# Altium schematic sheet HV60D_Top.SchDoc
size A1
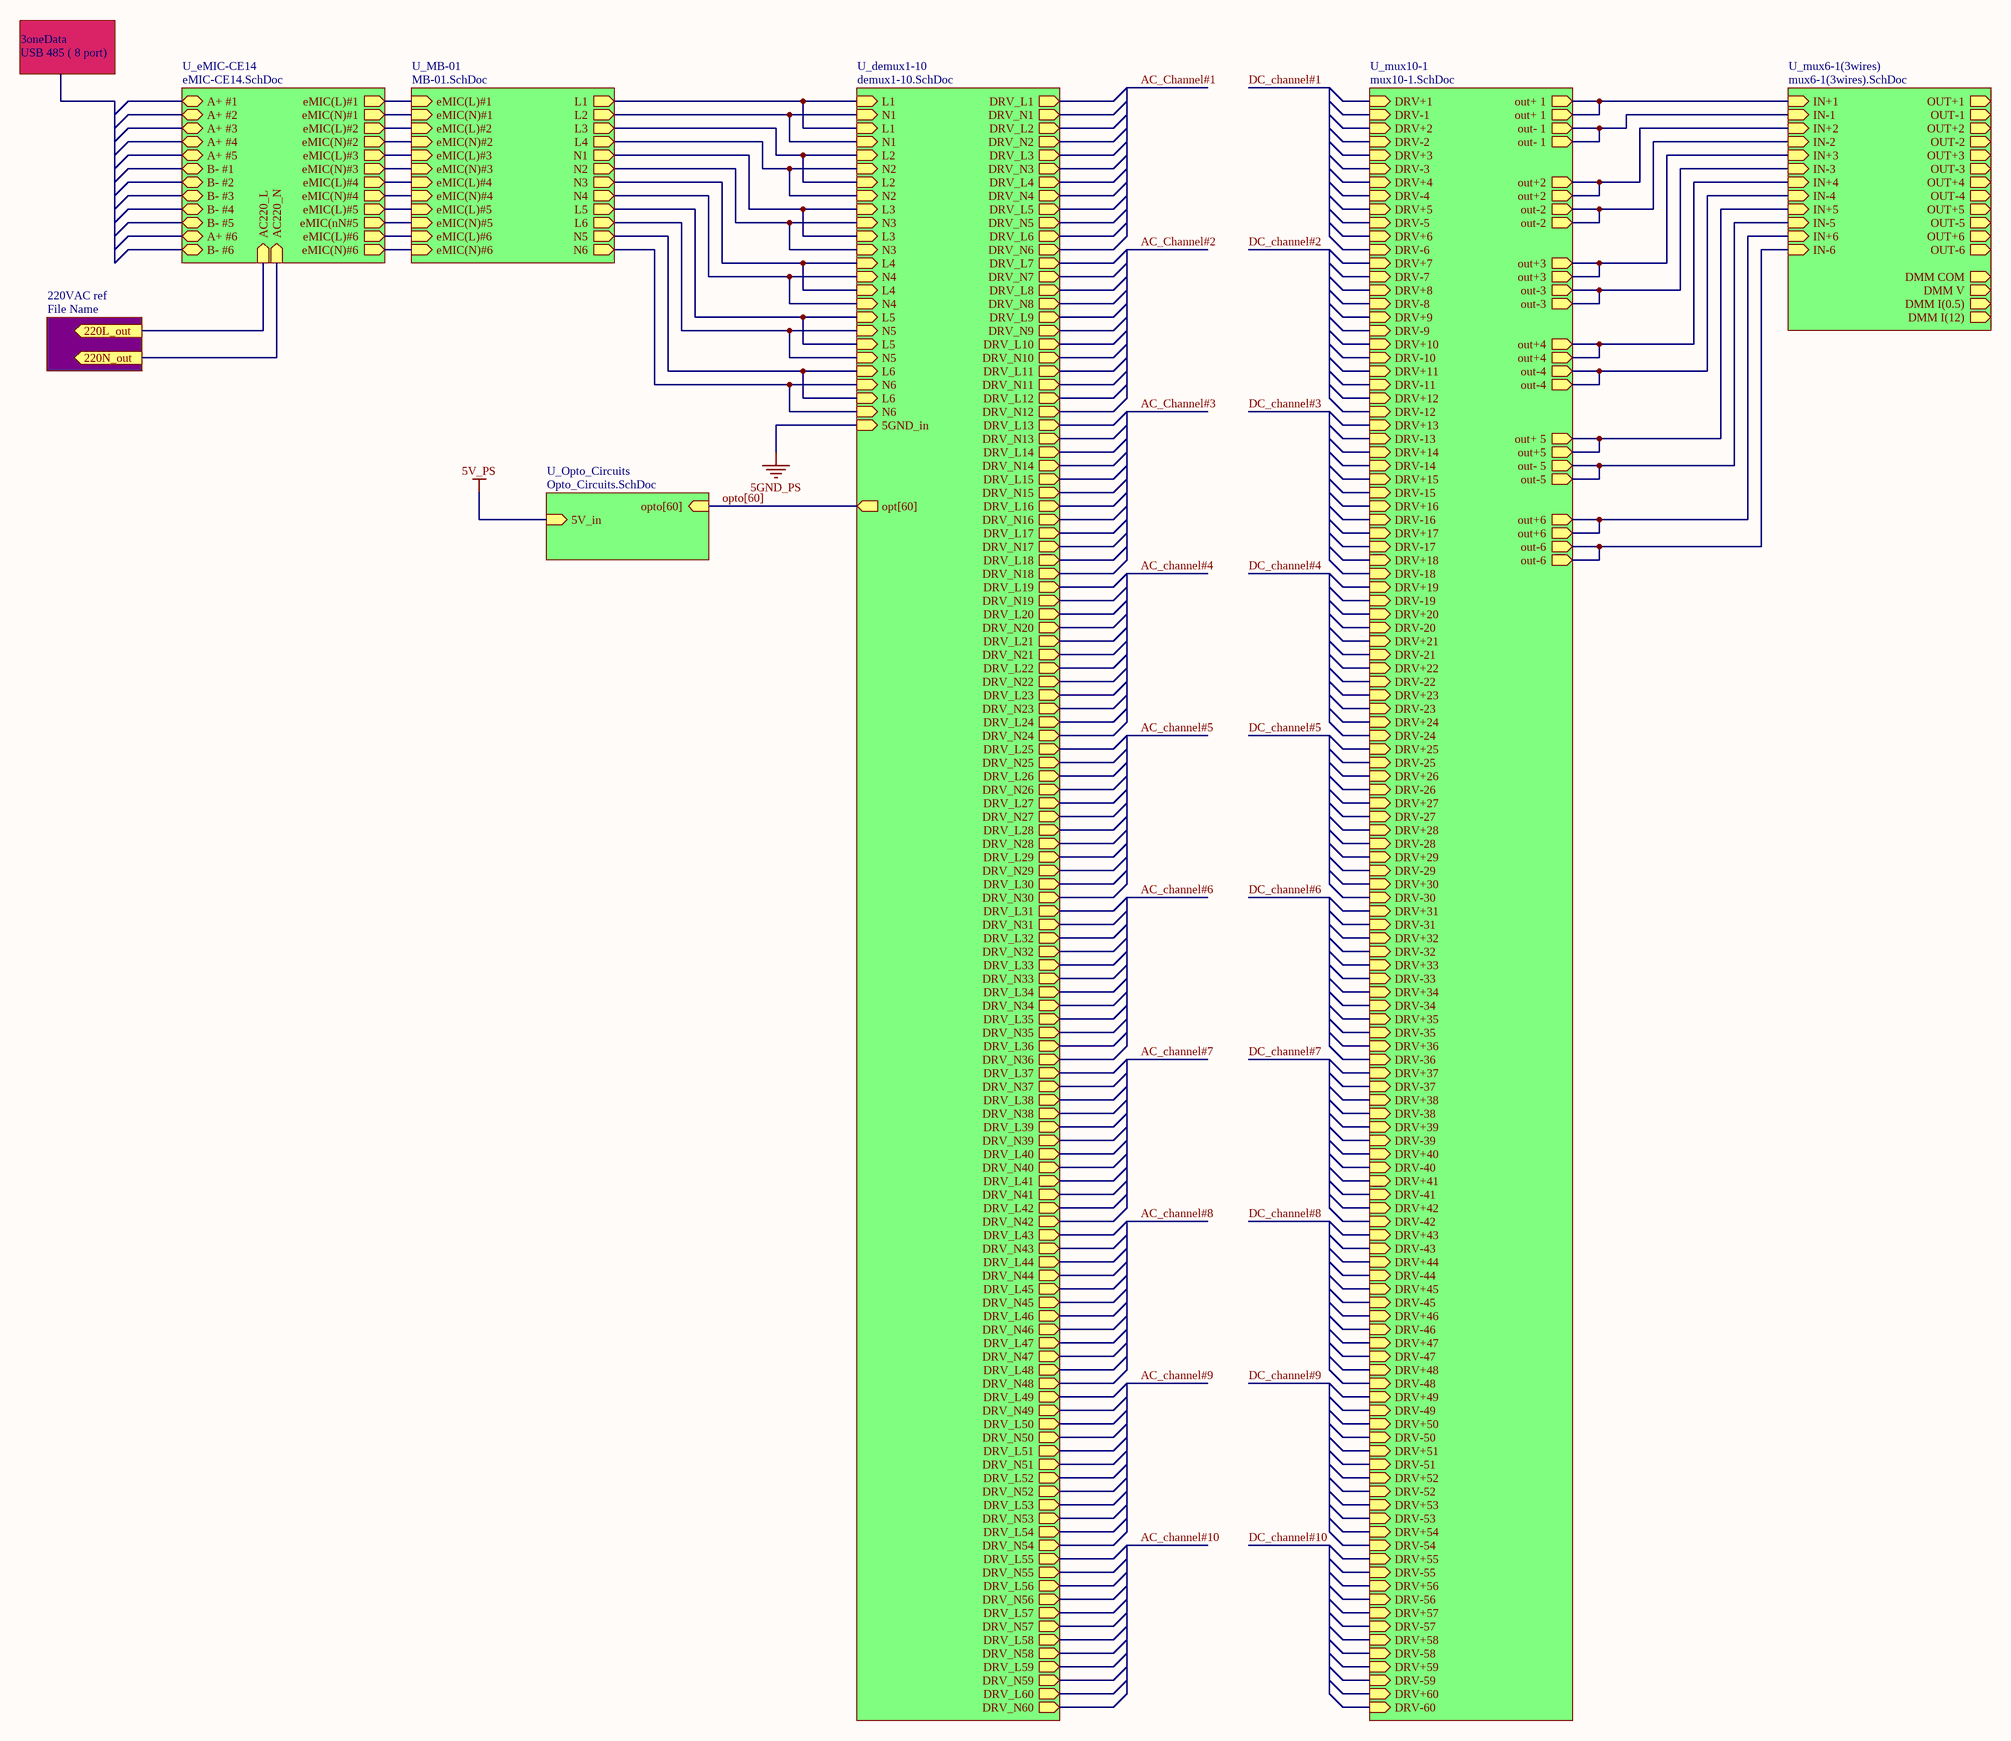
[diagram p0: HV60D_Top.SchDoc]

## Sub-sheets
220VAC ref = File Name: no entries
U_demux1-10 = demux1-10.SchDoc: L1 (in), N1 (in), L1 (in), N1 (in), DRV_L1 (out), DRV_L7 (out), L5 (in), N5 (in), L2 (in), N2 (in), L2 (in), N2 (in), L5 (in), N5 (in), L3 (in), N3 (in), L3 (in), N3 (in), L6 (in), N6 (in), L4 (in), N4 (in), L4 (in), N4 (in), L6 (in), N6 (in), DRV_L2 (out), DRV_L3 (out), DRV_L4 (out), DRV_L49 (out), DRV_L51 (out), DRV_L8 (out), DRV_L9 (out), DRV_L10 (out), DRV_L55 (out), DRV_L13 (out), DRV_L14 (out), DRV_L15 (out), DRV_L16 (out), DRV_L5 (out), DRV_L6 (out), DRV_L19 (out), DRV_L20 (out), DRV_L21 (out), DRV_L22 (out), DRV_L11 (out), DRV_L12 (out), DRV_L25 (out), DRV_L26 (out), DRV_L27 (out), DRV_L28 (out), DRV_L17 (out), DRV_L18 (out), DRV_L31 (out), DRV_L32 (out), DRV_L33 (out), DRV_L34 (out), DRV_L23 (out), DRV_L24 (out), DRV_L37 (out), DRV_L38 (out), DRV_L39 (out), DRV_L40 (out), DRV_L29 (out), DRV_L30 (out), DRV_L43 (out), DRV_L44 (out), DRV_L45 (out), DRV_L46 (out), DRV_L50 (out), DRV_L52 (out), DRV_L58 (out), DRV_L56 (out), DRV_L57 (out), DRV_L35 (out), DRV_L41 (out), DRV_L47 (out), DRV_L53 (out), DRV_L59 (out), DRV_L36 (out), DRV_L42 (out), DRV_L48 (out), DRV_L54 (out), DRV_L60 (out), DRV_N1 (out), DRV_N2 (out), DRV_N3 (out), DRV_N4 (out), DRV_N5 (out), DRV_N6 (out), DRV_N7 (out), DRV_N8 (out), DRV_N9 (out), DRV_N10 (out), DRV_N11 (out), DRV_N12 (out), DRV_N13 (out), DRV_N14 (out), DRV_N15 (out), DRV_N16 (out), DRV_N17 (out), DRV_N18 (out), DRV_N19 (out), DRV_N20 (out), DRV_N21 (out), DRV_N22 (out), DRV_N23 (out), DRV_N24 (out), DRV_N25 (out), DRV_N26 (out), DRV_N27 (out), DRV_N28 (out), DRV_N29 (out), DRV_N30 (out), DRV_N31 (out), DRV_N32 (out), DRV_N33 (out), DRV_N34 (out), DRV_N35 (out), DRV_N36 (out), DRV_N37 (out), DRV_N38 (out), DRV_N39 (out), DRV_N40 (out), DRV_N41 (out), DRV_N42 (out), DRV_N43 (out), DRV_N44 (out), DRV_N45 (out), DRV_N46 (out), DRV_N47 (out), DRV_N48 (out), DRV_N49 (out), DRV_N50 (out), DRV_N51 (out), DRV_N52 (out), DRV_N53 (out), DRV_N54 (out), DRV_N55 (out), DRV_N56 (out), DRV_N57 (out), DRV_N58 (out), DRV_N59 (out), DRV_N60 (out), opt[60] (out), 5GND_in (in)
U_eMIC-CE14 = eMIC-CE14.SchDoc: A+ #1 (bidir), A+ #2 (bidir), A+ #3 (bidir), A+ #4 (bidir), A+ #5 (bidir), B- #1 (bidir), B- #2 (bidir), B- #3 (bidir), B- #4 (bidir), B- #5 (bidir), A+ #6 (bidir), B- #6 (bidir), AC220_L (in), AC220_N (in), eMIC(L)#1 (out), eMIC(N)#1 (out), eMIC(L)#2 (out), eMIC(L)#3 (out), eMIC(L)#4 (out), eMIC(L)#5 (out), eMIC(L)#6 (out), eMIC(N)#2 (out), eMIC(N)#3 (out), eMIC(N)#4 (out), eMIC(nN#5 (out), eMIC(N)#6 (out)
U_MB-01 = MB-01.SchDoc: eMIC(L)#1 (in), eMIC(L)#2 (in), eMIC(L)#3 (in), eMIC(L)#4 (in), eMIC(N)#1 (in), eMIC(N)#2 (in), eMIC(N)#3 (in), eMIC(N)#4 (in), L1 (out), L2 (out), L3 (out), L4 (out), N1 (out), N2 (out), N3 (out), N4 (out), eMIC(L)#5 (in), eMIC(L)#6 (in), eMIC(N)#5 (in), eMIC(N)#6 (in), L5 (out), L6 (out), N5 (out), N6 (out)
U_mux6-1(3wires) = mux6-1(3wires).SchDoc: IN+1 (in), IN+2 (in), IN+3 (in), IN+4 (in), IN+5 (in), IN+6 (in), IN-1 (in), IN-2 (in), IN-3 (in), IN-4 (in), IN-5 (in), IN-6 (in), OUT+1 (out), OUT+2 (out), OUT+3 (out), OUT+4 (out), OUT+5 (out), OUT+6 (out), OUT-6 (out), OUT-5 (out), OUT-4 (out), OUT-3 (out), OUT-2 (out), OUT-1 (out), DMM COM (out), DMM V (out), DMM I(0.5) (out), DMM I(12) (out)
U_mux10-1 = mux10-1.SchDoc: out+ 1 (out), out- 1 (out), out+ 1 (out), out- 1 (out), out+ 5 (out), out- 5 (out), DRV+1 (in), DRV+7 (in), DRV+13 (in), DRV+19 (in), DRV+25 (in), DRV+31 (in), DRV+37 (in), DRV+43 (in), DRV-1 (in), DRV-7 (in), DRV-13 (in), DRV-19 (in), DRV-25 (in), DRV-31 (in), DRV-37 (in), DRV-43 (in), DRV+49 (in), DRV+55 (in), DRV+5 (in), DRV+11 (in), DRV+17 (in), DRV+23 (in), DRV+29 (in), DRV-49 (in), DRV-55 (in), DRV-5 (in), DRV-11 (in), DRV-17 (in), DRV-23 (in), DRV-29 (in), out+2 (out), out-2 (out), out+2 (out), out-2 (out), out+5 (out), out-5 (out), DRV+2 (in), DRV+8 (in), DRV+14 (in), DRV+20 (in), DRV+26 (in), DRV+32 (in), DRV+38 (in), DRV+44 (in), DRV-2 (in), DRV-8 (in), DRV-14 (in), DRV-20 (in), DRV-26 (in), DRV-32 (in), DRV-38 (in), DRV-44 (in), DRV+50 (in), DRV+56 (in), DRV+35 (in), DRV+41 (in), DRV+47 (in), DRV+53 (in), DRV+59 (in), DRV-50 (in), DRV-56 (in), DRV-35 (in), DRV-41 (in), DRV-47 (in), DRV-53 (in), DRV-59 (in), out+3 (out), out-3 (out), out+3 (out), out-3 (out), out+6 (out), out-6 (out), DRV+3 (in), DRV+9 (in), DRV+15 (in), DRV+21 (in), DRV+27 (in), DRV+33 (in), DRV+39 (in), DRV+45 (in), DRV-3 (in), DRV-9 (in), DRV-15 (in), DRV-21 (in), DRV-27 (in), DRV-33 (in), DRV-39 (in), DRV-45 (in), DRV+51 (in), DRV+57 (in), DRV+6 (in), DRV+12 (in), DRV+18 (in), DRV+24 (in), DRV+30 (in), DRV-51 (in), DRV-57 (in), DRV-6 (in), DRV-12 (in), DRV-18 (in), DRV-24 (in), DRV-30 (in), out+4 (out), out-4 (out), out+4 (out), out-4 (out), out+6 (out), out-6 (out), DRV+4 (in), DRV+10 (in), DRV+16 (in), DRV+22 (in), DRV+28 (in), DRV+34 (in), DRV+40 (in), DRV+46 (in), DRV-4 (in), DRV-10 (in), DRV-16 (in), DRV-22 (in), DRV-28 (in), DRV-34 (in), DRV-40 (in), DRV-46 (in), DRV+52 (in), DRV+58 (in), DRV+36 (in), DRV+42 (in), DRV+48 (in), DRV+54 (in), DRV+60 (in), DRV-52 (in), DRV-58 (in), DRV-36 (in), DRV-42 (in), DRV-48 (in), DRV-54 (in), DRV-60 (in)
U_Opto_Circuits = Opto_Circuits.SchDoc: opto[60] (in), 5V_in (in)
USB 485 ( 8 port) = 3oneData: no entries

## Ports
220L_out (out), 220N_out (out)

## Nets
5GND_PS: sheet U_demux1-10/5GND_in
5V_PS: sheet U_Opto_Circuits/5V_in
220L_out: port 220L_out, sheet U_eMIC-CE14/AC220_L
220N_out: port 220N_out, sheet U_eMIC-CE14/AC220_N
(unnamed): sheet U_demux1-10/L1, sheet U_demux1-10/L1, sheet U_MB-01/L1
(unnamed): sheet U_demux1-10/N1, sheet U_demux1-10/N1, sheet U_MB-01/L2
(unnamed): sheet U_demux1-10/L5, sheet U_demux1-10/L5, sheet U_MB-01/L5
(unnamed): sheet U_demux1-10/N5, sheet U_demux1-10/N5, sheet U_MB-01/L6
(unnamed): sheet U_demux1-10/L2, sheet U_demux1-10/L2, sheet U_MB-01/L3
(unnamed): sheet U_demux1-10/N2, sheet U_demux1-10/N2, sheet U_MB-01/L4
(unnamed): sheet U_demux1-10/L3, sheet U_demux1-10/L3, sheet U_MB-01/N1
(unnamed): sheet U_demux1-10/N3, sheet U_demux1-10/N3, sheet U_MB-01/N2
(unnamed): sheet U_demux1-10/L6, sheet U_demux1-10/L6, sheet U_MB-01/N5
(unnamed): sheet U_demux1-10/N6, sheet U_demux1-10/N6, sheet U_MB-01/N6
(unnamed): sheet U_demux1-10/L4, sheet U_demux1-10/L4, sheet U_MB-01/N3
(unnamed): sheet U_demux1-10/N4, sheet U_demux1-10/N4, sheet U_MB-01/N4
(unnamed): sheet U_MB-01/eMIC(L)#1, sheet U_eMIC-CE14/eMIC(L)#1
(unnamed): sheet U_MB-01/eMIC(L)#2, sheet U_eMIC-CE14/eMIC(L)#2
(unnamed): sheet U_MB-01/eMIC(L)#3, sheet U_eMIC-CE14/eMIC(L)#3
(unnamed): sheet U_MB-01/eMIC(L)#4, sheet U_eMIC-CE14/eMIC(L)#4
(unnamed): sheet U_MB-01/eMIC(N)#1, sheet U_eMIC-CE14/eMIC(N)#1
(unnamed): sheet U_MB-01/eMIC(N)#2, sheet U_eMIC-CE14/eMIC(N)#2
(unnamed): sheet U_MB-01/eMIC(N)#3, sheet U_eMIC-CE14/eMIC(N)#3
(unnamed): sheet U_MB-01/eMIC(N)#4, sheet U_eMIC-CE14/eMIC(N)#4
(unnamed): sheet U_MB-01/eMIC(L)#5, sheet U_eMIC-CE14/eMIC(L)#5
(unnamed): sheet U_MB-01/eMIC(L)#6, sheet U_eMIC-CE14/eMIC(L)#6
(unnamed): sheet U_MB-01/eMIC(N)#5, sheet U_eMIC-CE14/eMIC(nN#5
(unnamed): sheet U_MB-01/eMIC(N)#6, sheet U_eMIC-CE14/eMIC(N)#6
(unnamed): sheet U_mux10-1/out+ 1, sheet U_mux10-1/out+ 1, sheet U_mux6-1(3wires)/IN+1
(unnamed): sheet U_mux10-1/out- 1, sheet U_mux10-1/out- 1, sheet U_mux6-1(3wires)/IN-1
(unnamed): sheet U_mux10-1/out+ 5, sheet U_mux10-1/out+5, sheet U_mux6-1(3wires)/IN+5
(unnamed): sheet U_mux10-1/out- 5, sheet U_mux10-1/out-5, sheet U_mux6-1(3wires)/IN-5
(unnamed): sheet U_mux10-1/out+2, sheet U_mux10-1/out+2, sheet U_mux6-1(3wires)/IN+2
(unnamed): sheet U_mux10-1/out-2, sheet U_mux10-1/out-2, sheet U_mux6-1(3wires)/IN-2
(unnamed): sheet U_mux10-1/out+3, sheet U_mux10-1/out+3, sheet U_mux6-1(3wires)/IN+3
(unnamed): sheet U_mux10-1/out-3, sheet U_mux10-1/out-3, sheet U_mux6-1(3wires)/IN-3
(unnamed): sheet U_mux10-1/out+6, sheet U_mux10-1/out+6, sheet U_mux6-1(3wires)/IN+6
(unnamed): sheet U_mux10-1/out-6, sheet U_mux10-1/out-6, sheet U_mux6-1(3wires)/IN-6
(unnamed): sheet U_mux10-1/out+4, sheet U_mux10-1/out+4, sheet U_mux6-1(3wires)/IN+4
(unnamed): sheet U_mux10-1/out-4, sheet U_mux10-1/out-4, sheet U_mux6-1(3wires)/IN-4

## Buses and harness runs
bus AC_Channel#1
bus AC_Channel#2
bus AC_Channel#3
bus AC_channel#4
bus AC_channel#5
bus AC_channel#6
bus AC_channel#7
bus AC_channel#8
bus AC_channel#9
bus AC_channel#10
bus DC_channel#1
bus DC_channel#2
bus DC_channel#3
bus DC_channel#4
bus DC_channel#5
bus DC_channel#6
bus DC_channel#7
bus DC_channel#8
bus DC_channel#9
bus DC_channel#10
bus opto[60] = sheet U_demux1-10/opt[60] = sheet U_Opto_Circuits/opto[60]